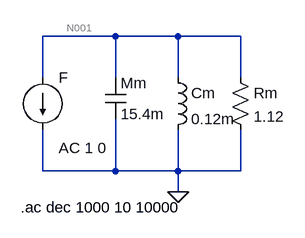
[diagram p0: schematic ex1_massamola_inverso.asc]
ex1_massamola_inverso.asc, the LTspice schematic file:
Version 4
SHEET 1 880 680
WIRE 176 48 64 48
WIRE 272 48 176 48
WIRE 368 48 272 48
WIRE 64 112 64 48
WIRE 176 112 176 48
WIRE 272 112 272 48
WIRE 368 112 368 48
WIRE 64 256 64 192
WIRE 176 256 176 176
WIRE 176 256 64 256
WIRE 272 256 272 192
WIRE 272 256 176 256
WIRE 368 256 368 192
WIRE 368 256 272 256
WIRE 272 288 272 256
FLAG 272 288 0
SYMBOL current 64 112 R0
WINDOW 123 24 108 Left 2
WINDOW 39 0 0 Left 0
SYMATTR Value2 AC 1 0
SYMATTR InstName F
SYMATTR Value ""
SYMBOL cap 160 112 R0
SYMATTR InstName Mm
SYMATTR Value 15.4m
SYMBOL ind 256 96 R0
SYMATTR InstName Cm
SYMATTR Value 0.12m
SYMBOL res 352 96 R0
SYMATTR InstName Rm
SYMATTR Value 1.12
TEXT 30 312 Left 2 !.ac dec 1000 10 10000

The netlist it stands for:
* ex1_massamola_inverso.asc
I§F N001 0 AC 1 0
C§Mm N001 0 15.4m
L§Cm N001 0 0.12m
Rm N001 0 1.12
.ac dec 1000 10 10000
.backanno
.end

* Results of the author's LTspice run, read from the files saved beside the schematic
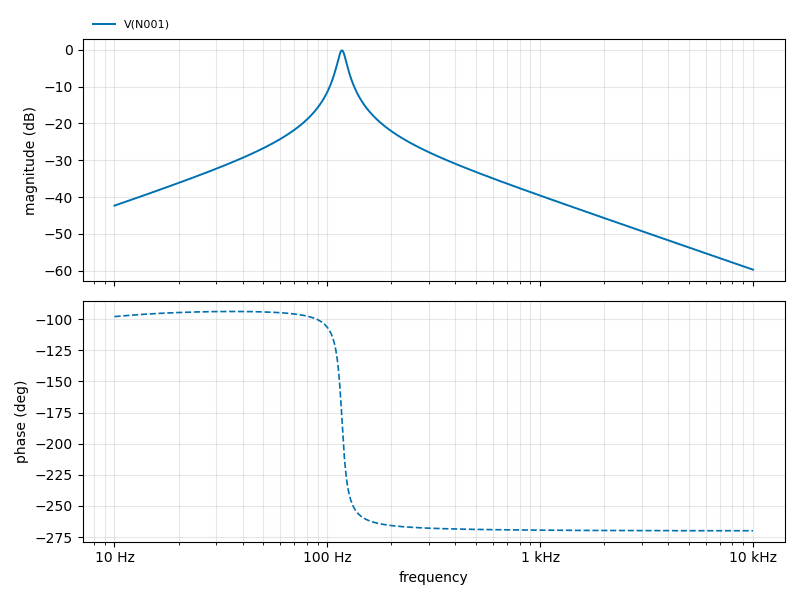
[diagram p1: AC Analysis of ex1_massamola_inverso.asc, plotted from the saved traces]
* AC Analysis, 1 run:
*   V(N001): -42.32 dB at 10 Hz, -59.71 dB at 10 kHz, peak -0.18 dB at 117.2 Hz, 3 dB below the peak at 112 Hz and 122.5 Hz